# EAGLE design stepper (EAGLE 7.5.0)
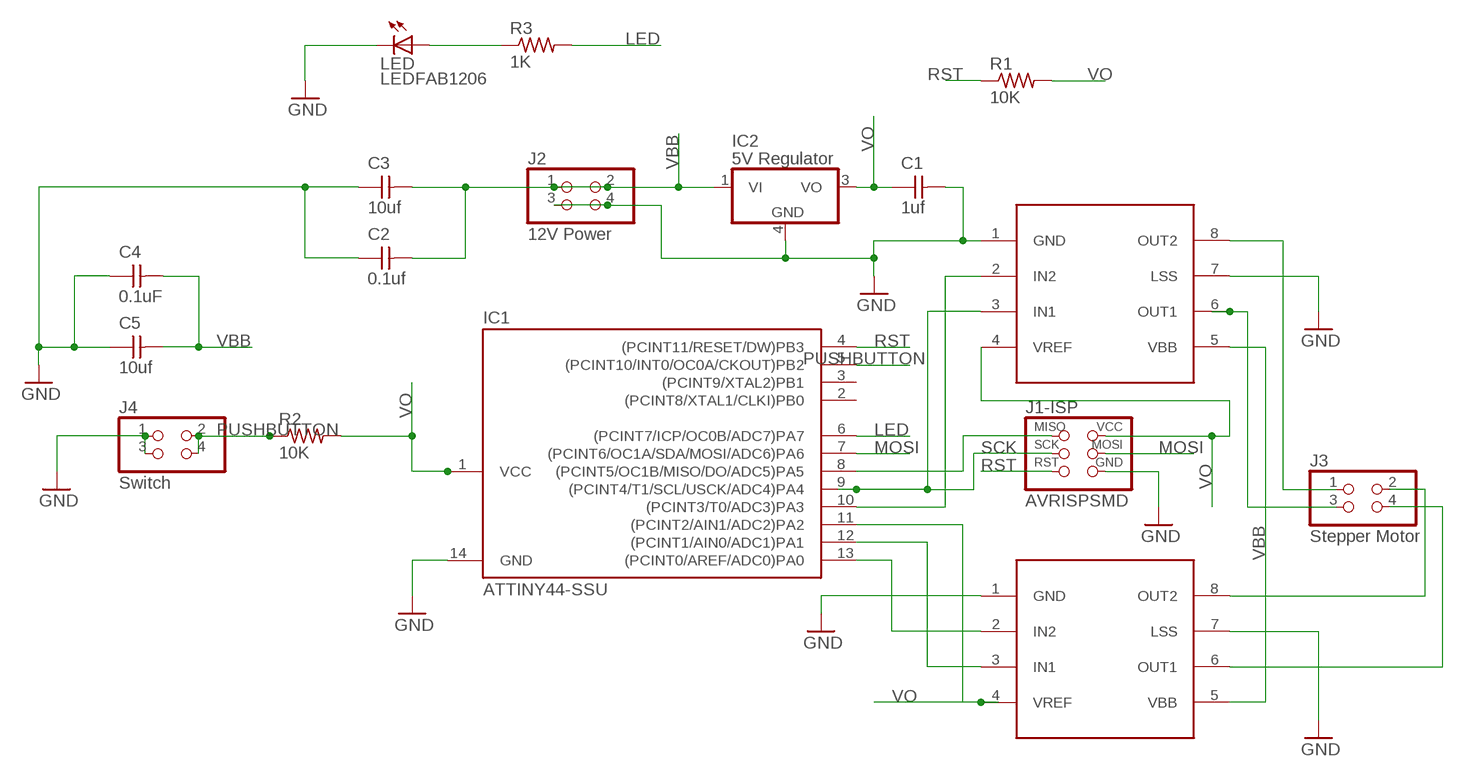
[diagram p0: schematic, sheet 1]

## Parts
C1  1uf  CAP-UNPOLARIZEDFAB  [C1206FAB]
C2  0.1uf  CAP-UNPOLARIZEDFAB  [C1206FAB]
C3  10uf  CAP-UNPOLARIZEDFAB  [C1206FAB]
C4  0.1uF  CAP-UNPOLARIZEDFAB  [C1206FAB]
C5  10uf  CAP-UNPOLARIZEDFAB  [C1206FAB]
IC1  ATTINY44-SSU  [SOIC14]
IC2  5V Regulator  LM340MP-05  [SOT223]
IC3  A4950  A4953-H-BRIDGE-MOTOR-DRIVER  [SOIC8]
IC4  A4950  A4953-H-BRIDGE-MOTOR-DRIVER  [SOIC8]
J1-ISP  AVRISPSMD  [2X03SMD]
J2  12V Power  PINHD-2X2-SMD  [2X02SMD]
J3  Stepper Motor  PINHD-2X2-SMD  [2X02SMD]
J4  Switch  PINHD-2X2-SMD  [2X02SMD]
LED  LEDFAB1206  [LED1206FAB]
R1  10K  RES-US1206FAB  [R1206FAB]
R2  10K  RES-US1206FAB  [R1206FAB]
R3  1K  RES-US1206FAB  [R1206FAB]

## Nets
GND: C1.2 C2.1 C3.1 C4.1 C5.1 IC1.14(GND) IC2.4(GND) IC3.1(GND) IC3.7(LSS) IC4.1(GND) IC4.7(LSS) J1-ISP.6(GND) J2.3 J2.4 J4.1 J4.3 LED.2(C)
LED: IC1.6((PCINT7/ICP/OC0B/ADC7)PA7) R3.2
MOSI: IC1.7((PCINT6/OC1A/SDA/MOSI/ADC6)PA6) J1-ISP.4(MOSI)
N$1: IC1.13((PCINT0/AREF/ADC0)PA0) IC3.2(IN2)
N$2: IC1.12((PCINT1/AIN0/ADC1)PA1) IC3.3(IN1)
N$4: IC1.10((PCINT3/T0/ADC3)PA3) IC4.2(IN2)
N$5: IC4.8(OUT2) J3.1
N$6: IC4.6(OUT1) J3.3
N$7: IC3.8(OUT2) J3.2
N$8: IC1.8((PCINT5/OC1B/MISO/DO/ADC5)PA5) J1-ISP.1(MISO)
N$9: IC3.6(OUT1) J3.4
N$10: LED.1(A) R3.1
PUSHBUTTON: IC1.5((PCINT10/INT0/OC0A/CKOUT)PB2) J4.2 J4.4 R2.1
RST: IC1.4((PCINT11/RESET/DW)PB3) J1-ISP.5(RST) R1.1
SCK: IC1.9((PCINT4/T1/SCL/USCK/ADC4)PA4) IC4.3(IN1) J1-ISP.3(SCK)
VBB: C2.2 C3.2 C4.2 C5.2 IC2.1(VI) IC3.5(VBB) IC4.5(VBB) J2.1 J2.2
VO: C1.1 IC1.1(VCC) IC1.11((PCINT2/AIN1/ADC2)PA2) IC2.3(VO) IC3.4(VREF) IC4.4(VREF) J1-ISP.2(VCC) R1.2 R2.2
Unconnected: IC1.2((PCINT8/XTAL1/CLKI)PB0) IC1.3((PCINT9/XTAL2)PB1)

## Library data of the parts
C1-C5 = fab:CAP-UNPOLARIZED
IC1 = fab:ATTINY44
IC2 = linear:LM340?-*: Positive VOLTAGE REGULATOR Source: http://cache.national.com/ds/LM/LM340.pdf
IC3 IC4 = fab:A4953-H-BRIDGE-MOTOR-DRIVER
J1-ISP = fab:AVRISP
J2-J4 = fab:PINHD-2X2-SMD
LED = fab:LED: LED
R1-R3 = fab:RES-US: Resistor (US Symbol) Variants with postfix FAB are widened to allow the routing of internal traces

## Board
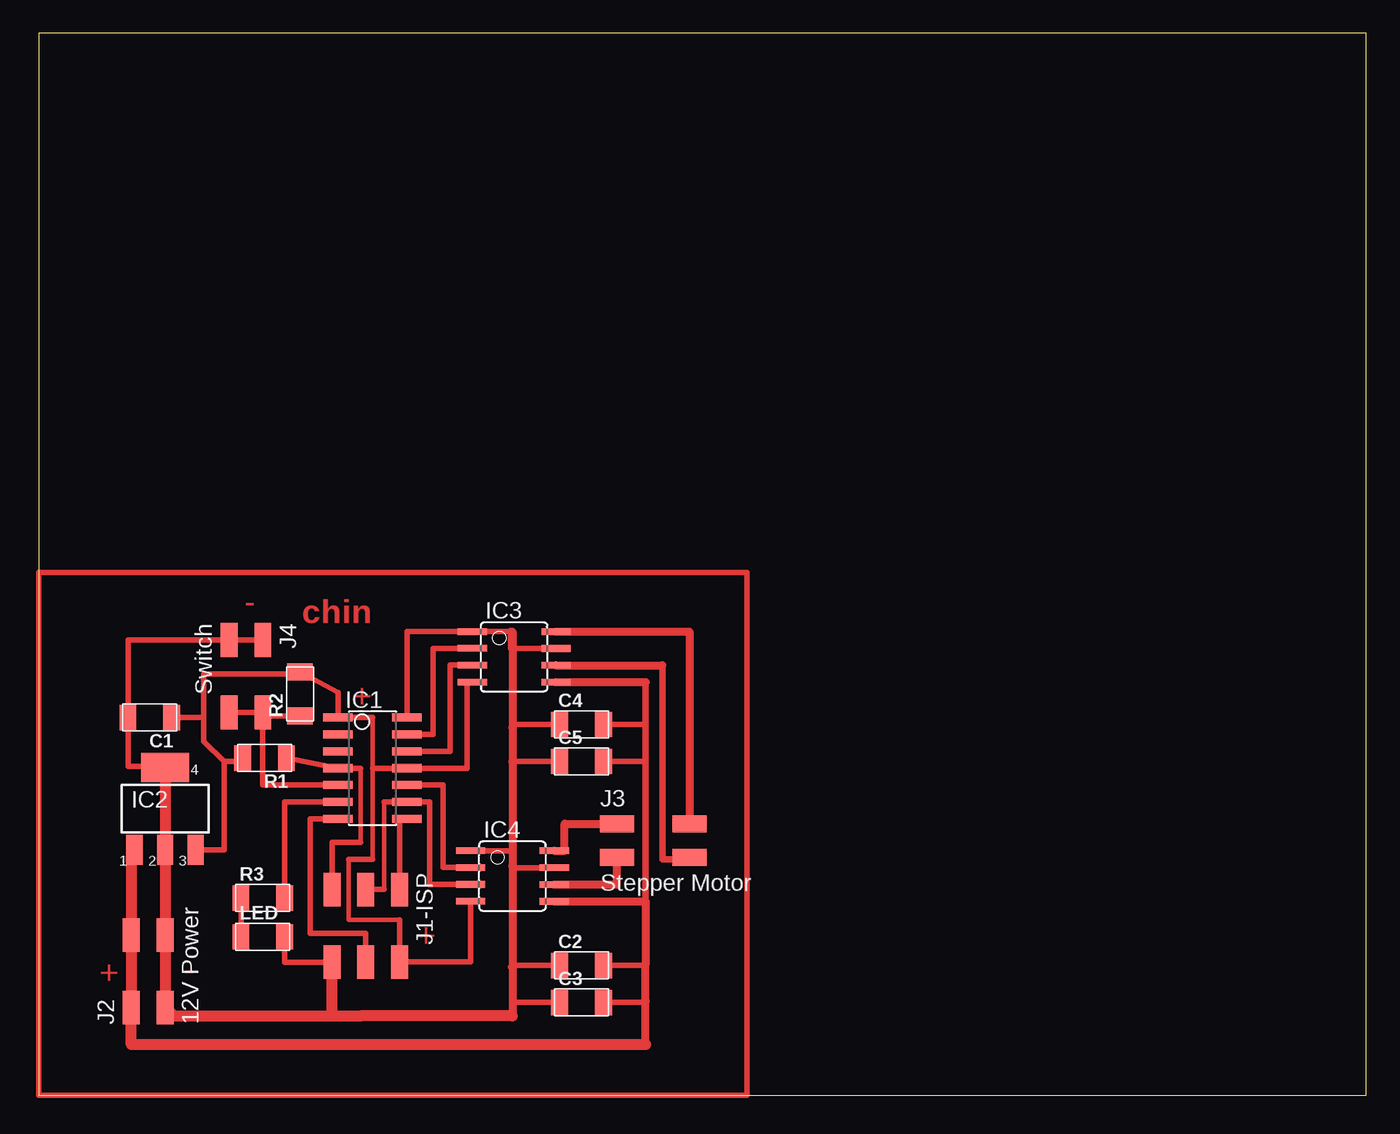
[diagram p1: board, top side]

Size 100 x 80 mm. Coordinates in mm from the lower left corner, seen from the top.
Outline: 0,0 100,0 100,80 0,80 0,0
Copper layers (1*16): Top 0.035mm / dielectric 1.5mm / Bottom 0.035mm
Design rules "default": minimum track width 10mil, minimum drill 24mil, track to track 8mil, track to pad 8mil, pad to pad 8mil, via to via 8mil, smd to smd 8mil, copper to edge 40mil, drill to drill 8mil, minimum pad ring 10mil, minimum via ring 8mil, stop-mask expansion 4mil, vias tented up to drill 0mil, thermal gap 10mil

### Footprints (pad centres in the part's own frame; a part is rotated, then mirrored left to right if it is on the bottom)
C1206FAB = smd 1.27 x 1.905: 1 -1.651,0; 2 1.651,0
SOIC14 = smd 0.61 x 2.21: 1 -3.81,-2.603; 2 -2.54,-2.603; 3 -1.27,-2.603; 4 0,-2.603; 5 1.27,-2.603; 6 2.54,-2.603; 7 3.81,-2.603; 8 3.81,2.603; 9 2.54,2.603; 10 1.27,2.603; 11 0,2.603; 12 -1.27,2.603; 13 -2.54,2.603; 14 -3.81,2.603
SOT223 = smd 1.219 x 2.235: 1 -2.311,-3.099; 2 0,-3.099; 3 2.311,-3.099 | smd 3.6 x 2.2: 4 0,3.099
SOIC8 = smd 0.5 x 2.2: 1 -1.905,-3.154; 2 -0.645,-3.154; 3 0.625,-3.154; 4 1.895,-3.154; 5 1.905,3.154; 6 0.635,3.154; 7 -0.635,3.154; 8 -1.905,3.154
2X03SMD = smd 2.54 x 1.27: 1 -2.54,2.54; 2 2.92,2.54; 3 -2.54,0; 4 2.92,0; 5 -2.54,-2.54; 6 2.92,-2.54
2X02SMD = smd 2.54 x 1.27: 1 -2.54,1.27; 2 2.92,1.27; 3 -2.54,-1.27; 4 2.92,-1.27
LED1206FAB = smd 1.27 x 1.905: 1 -1.651,0; 2 1.651,0
R1206FAB = smd 1.27 x 1.905: 1 -1.651,0; 2 1.651,0

### Placement (x,y rotation side)
C1  8.38,28.45 180 top
C2  40.89,9.78 0 top
C3  40.89,6.99 0 top
C4  40.89,27.94 0 top
C5  40.89,25.15 0 top
IC1  25.15,24.64 270 top
IC2  9.53,21.59 0 top
IC3  35.81,33.02 270 top
IC4  35.69,16.51 270 top
J1-ISP  24.64,12.95 270 top
J2  8.26,9.14 90 top
J3  46.1,19.18 0 top
J4  15.62,31.75 270 top
LED  16.89,11.94 0 top
R1  17.02,25.4 180 top
R2  19.68,30.23 90 top
R3  16.89,14.86 0 top

### Tracks (layer width: path | path; a pad name or v marks a point on that pad's centre or on a via)
GND
  Top 0.406: IC1.14 27.75,34.92 IC3.1 35.57,34.92 35.57,33.66 IC3.7 | C2.1 35.65,9.78 35.65,9.64 | C3.1 35.69,6.99 | 35.67,7.11 35.67,6.99 35.69,6.99 | IC4.1 35.69,18.41 35.69,18.29 | IC4.7 35.69,17.14 35.69,17.27 | 35.69,6.99 35.69,6.1 | C4.1 35.69,27.94 35.69,27.69 | C5.1 35.69,25.15 | LED.2 18.54,10.03 J1-ISP.6 | J4.1 J4.3 6.73,34.29 C1.2 6.73,24.77 10.16,24.77 IC2.4
  Top 0.61: 35.57,34.92 35.69,34.92 35.69,27.69 35.69,25.15 35.69,18.29 35.69,17.27 35.69,9.64 | 35.65,9.64 35.69,9.64 | 35.69,9.64 35.69,6.1 35.69,5.97
  Top 0.813: 22.1,5.97 10.16,5.97 J2.3 J2.4 IC2.4 | 22.1,5.97 24.26,5.97 35.69,5.97 | 22.1,5.97 J1-ISP.6
LED
  Top 0.406: IC1.6 18.54,22.1 R3.2
MOSI
  Top 0.406: IC1.7 20.45,20.83 20.45,12.19 24.64,12.19 J1-ISP.4
N$1
  Top 0.406: IC3.2 29.72,33.66 29.72,27.18 IC1.13
N$2
  Top 0.406: IC3.3 30.99,32.4 30.99,25.91 IC1.12
N$3
  Top 0.406: 0,0 0,39.37 53.34,39.37 53.34,0 0,0
N$4
  Top 0.406: 31.5,17.14 33.3,17.14 IC4.2 30.48,17.16 30.48,23.37 IC1.10
N$5
  Top 0.61: IC4.8 39.62,18.41 39.62,20.45 J3.1
N$6
  Top 0.61: IC4.6 43.56,15.88 J3.3
N$7
  Top 0.61: IC3.8 49.02,34.92 J3.2
N$8
  Top 0.406: IC1.8 27.18,20.83 J1-ISP.1
N$9
  Top 0.508: 46.99,32.38 46.99,17.78 49.02,17.78
  Top 0.61: IC3.6 46.99,32.38 | 49.02,17.78 J3.4
N$10
  Top 0.406: R3.1 LED.1
PUSHBUTTON
  Top 0.406: J4.4 J4.2 | J4.2 16.89,23.37 IC1.5 | J4.2 17.27,28.57 R2.1
RST
  Top 0.356: 24.26,24.64 24.26,19.05
  Top 0.406: R1.1 IC1.4 24.26,24.64 | 24.26,19.05 22.1,19.05 J1-ISP.5
SCK
  Top 0.356: 26.04,15.49 26.04,22.1
  Top 0.406: J1-ISP.3 26.04,15.49 | 26.04,22.1 IC1.9 29.46,22.1 29.46,15.88 32.53,15.88 IC4.3
VBB
  Top 0.406: C4.2 45.72,27.94 | C5.2 45.72,25.15 45.72,25.4 | C2.2 45.72,9.78 45.72,9.91 | C3.2 45.72,6.99 45.72,7.11
  Top 0.508: 45.72,31.11 45.72,27.94 45.72,25.4 45.72,14.61
  Top 0.61: IC3.5 45.72,31.11 | 45.72,3.81 45.72,7.11 45.72,9.91 45.72,14.61 IC4.5
  Top 0.813: IC2.1 6.99,18.49 J2.2 J2.1 6.99,3.81 45.72,3.81
VO
  Top 0.356: 27.18,13.21 23.37,13.21 23.37,17.78 | 25.15,17.78 25.15,24.64 25.15,28.45
  Top 0.406: IC2.3 13.97,18.49 13.97,25.15 | IC4.4 32.53,10.03 J1-ISP.2 27.18,13.21 | 23.37,17.78 25.15,17.78 | 25.15,28.45 IC1.1 | IC1.1 22.35,28.45 | IC1.1 22.54,30.35 R2.2 20.07,31.75 12.45,31.75 12.45,28.45 | C1.1 12.45,28.45 | 12.45,28.45 12.45,26.67 13.97,25.15 | 13.97,25.15 15.62,25.15 R1.2 | IC3.4 32.26,31.12 32.26,24.64 IC1.11 25.15,24.64

### Text on the board
Top: - | chin | + | + | - | +